# EAGLE schematic schematic_eagle (EAGLE 9.7.0)
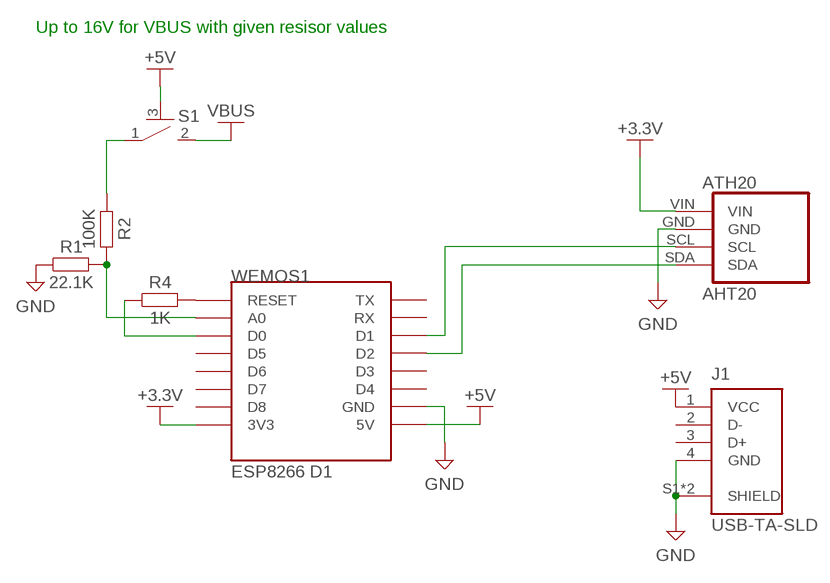
[diagram p0: schematic, sheet 1]

## Parts
ATH20  AHT20  [AHT20]
J1  USB-TA-SLD  [USB-TA-SLD]
R1  22.1K  R_CHIP-0805(2012-METRIC)  [RESC2012X65]
R2  100K  R_CHIP-0805(2012-METRIC)  [RESC2012X65]
R4  1K  R_CHIP-0805(2012-METRIC)  [RESC2012X65]
S1  SMD_SWB3U-1100P(M)1100P(M)  [SMD_SW]
WEMOS1  U1  WEMOS-D1-MINI  [WEMOS-D1-MINI]

## Nets
+3.3V [Power]: ATH20.VIN WEMOS1.3V3
+5V [Power]: J1.1(VCC) S1.3 WEMOS1.5V
GND [Power]: ATH20.GND J1.4(GND) J1.S1(SHIELD) J1.S2(SHIELD) R1.1 WEMOS1.GND
N$1: ATH20.SCL WEMOS1.D1
N$2: ATH20.SDA WEMOS1.D2
N$3 [Signal]: R4.2 WEMOS1.RESET
N$4 [Signal]: R4.1 WEMOS1.D0
N$5 [Signal]: R1.2 R2.2 WEMOS1.A0
N$6: R2.1 S1.1
VBUS: S1.2
Unconnected: J1.2(D-) J1.3(D+) WEMOS1.D3 WEMOS1.D4 WEMOS1.D5 WEMOS1.D6 WEMOS1.D7 WEMOS1.D8 WEMOS1.RX WEMOS1.TX

## Notes on the sheet
- Up to 16V for VBUS with given resisor values

## Library data of the parts
ATH20 = Jaisor Lib:AHT20: PIN HEADER; CATEGORY: Headers; DESCRIPTION: Header-Straight-4 Position; PACKAGE_TYPE: THT; PITCH: 0.100" (2.54mm); SUBCATEGORY: Headers-Male Pins; TYPE: Board to Board or Cable-Unshrouded-Through Hole-Straight
J1 = Jaisor Lib:USB-TA-SLD; MANUFACTURER: Molex; MAXIMUM_PACKAGE_HEIGHT: 4.6mm; PARTREV: D; STANDARD: Manufacturer Recommendations
R1 R2 R4 = Resistor:R: Resistor Fixed - Generic; CATEGORY: Resistors; DESCRIPTION: Chip Resistor 2.00 X 1.25 X 0.65 mm body 0805(2012-METRIC) Package; PACKAGE_SIZE: 0805; PACKAGE_TYPE: SMD
S1 = Jaisor Lib:SMD_SW: Ultra-small Tactile Switch Contact form : SPST-NO Datasheet <https://omronfs.omron.com/en_US/ecb/products/pdf/en-b3u.pdf>; CATEGORY: Switches; DATASHEET: https://omronfs.omron.com/en_US/ecb/products/pdf/en-b3u.pdf; DESCRIPTION: Tactile Switch SPST-NO Top Actuated Surface Mount; MANUFACTURER: Omron Electronics Inc-EMC Div; MPN: B3U-1100PM; OPERATING_TEMPERATURE: -25°C ~ 70°C; PACKAGE_SIZE: NA; PACKAGE_TYPE: SMD; PART_STATUS: ACTIVE; ROHS: COMPLIANT; SERIES: B3U; SUBCATEGORY: Tactile Switches; TYPE: SPST-NO
WEMOS1 = esp8266modules:WEMOS-D1-MINI: WeMos.cc D1 mini ESP8266 module; CN: ESP8266 D1

## Net classes
1 Power: width 0.61 mm
2 Signal: width 0.152 mm